# Altium schematic sheet Connectors.SchDoc
size A4
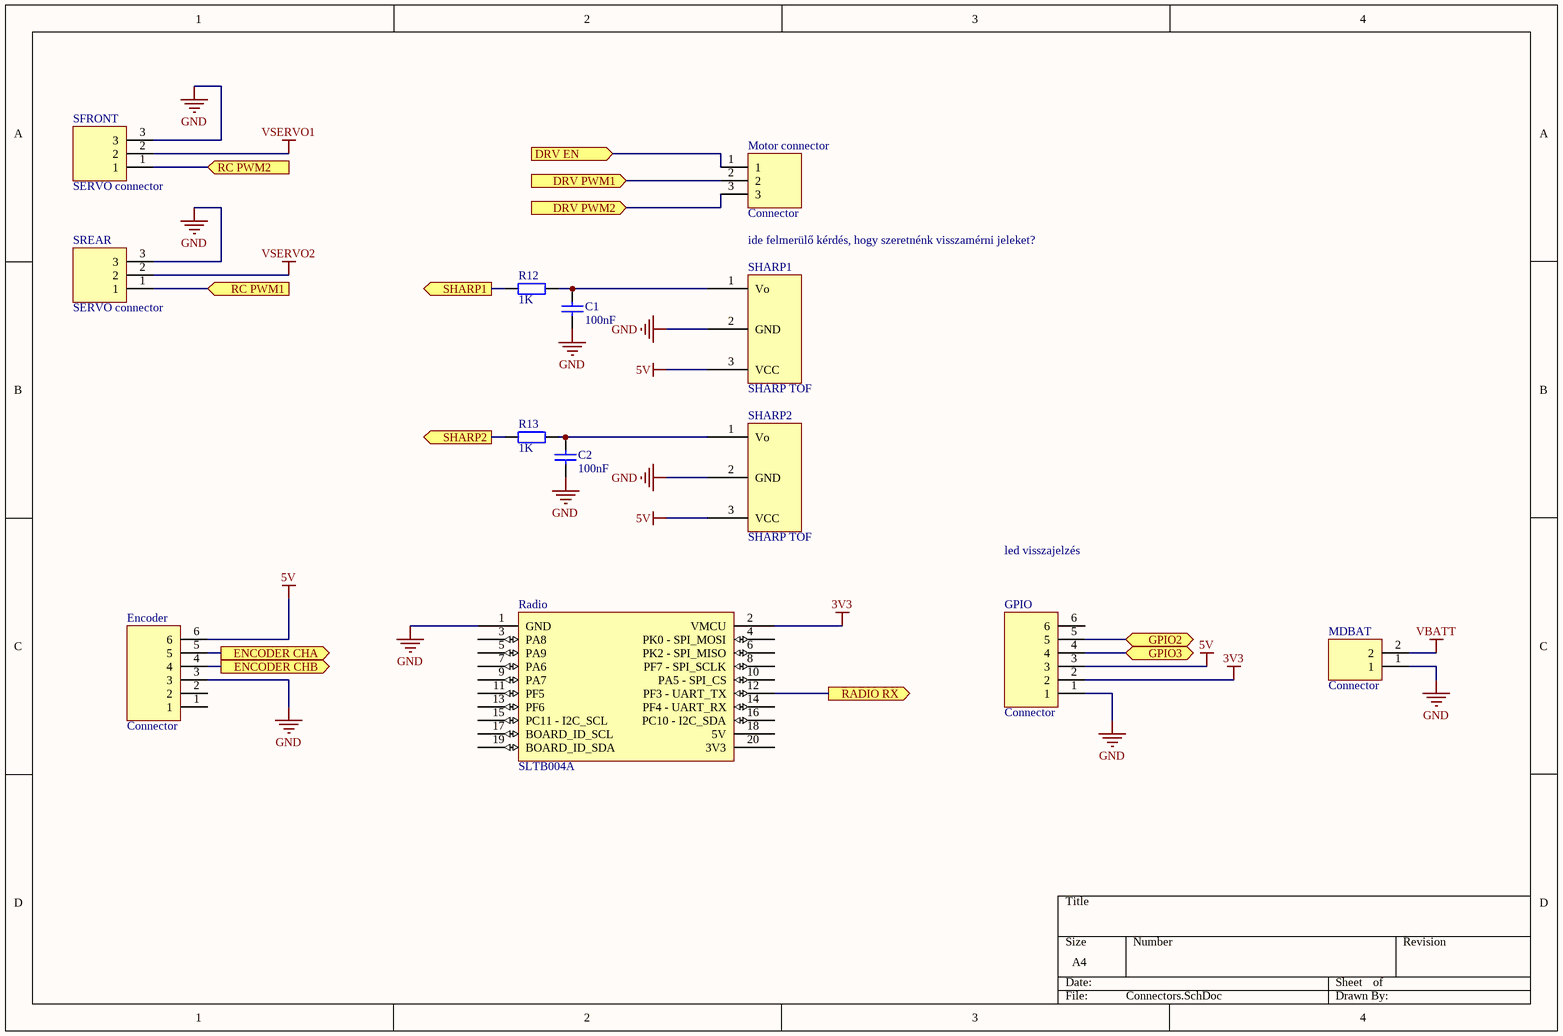
[diagram p0: Connectors.SchDoc]

## Parts
C1  100nF  [FP_0805_CAP_085]
C2  100nF  [FP_0805_CAP_085]
Encoder  Connector  [FP_CONN6PIN_2X3_254]
GPIO  Connector  [FP_CONN6PIN_2X3_254]
MDBAT  Connector  [CONN_2pin]
Motor_connector  Connector  [sorkapocs 3 pin]
R12  1K  [FP_0805_RES]
R13  1K  [FP_0805_RES]
Radio  SLTB004A  [SLTB004A]
SFRONT  SERVO connector  [RC_SERVO_CONN]
SHARP1  SHARP TOF  [SHARP TOF]
SHARP2  SHARP TOF  [SHARP TOF]
SREAR  SERVO connector  [RC_SERVO_CONN]

## Ports
DRV EN (in), DRV PWM1 (in), DRV PWM2 (in), ENCODER CHA (out), ENCODER CHB (out), GPIO2 (bidir), GPIO3 (bidir), RADIO RX (out), RC PWM1 (in), RC PWM2 (in), SHARP1 (out), SHARP2 (out)

## Nets
3V3: GPIO.2 Radio.2(VMCU)
5V: Encoder.6 GPIO.3 SHARP1.3(VCC) SHARP2.3(VCC)
GND: C1.1 C2.1 Encoder.3 GPIO.1 MDBAT.1 Radio.1(GND) SFRONT.3 SHARP1.2(GND) SHARP2.2(GND) SREAR.3
VBATT: MDBAT.2
VSERVO1: SFRONT.2
VSERVO2: SREAR.2
DRV EN: Motor_connector.1 ; port DRV EN
DRV PWM1: Motor_connector.2 ; port DRV PWM1
DRV PWM2: Motor_connector.3 ; port DRV PWM2
ENCODER CHA: Encoder.5 ; port ENCODER CHA
ENCODER CHB: Encoder.4 ; port ENCODER CHB
GPIO2: GPIO.5 ; port GPIO2
GPIO3: GPIO.4 ; port GPIO3
RADIO RX: Radio.12(PF3_-_UART_TX) ; port RADIO RX
RC PWM1: SREAR.1 ; port RC PWM1
RC PWM2: SFRONT.1 ; port RC PWM2
SHARP1: R12.1 ; port SHARP1
SHARP2: R13.1 ; port SHARP2
NetC1_2: C1.2 R12.2 SHARP1.1(Vo)
NetC2_2: C2.2 R13.2 SHARP2.1(Vo)

Not connected (* = marked no-connect by the designer): Encoder 1 2; GPIO 6; Radio 3(PA8) 4(PK0_-_SPI_MOSI) 5(PA9) 6(PK2_-_SPI_MISO) 7(PA6) 8(PF7_-_SPI_SCLK) 9(PA7) 10(PA5_-_SPI_CS) 11(PF5) 13(PF6) 14(PF4_-_UART_RX) 15(PC11_-_I2C_SCL) 16(PC10_-_I2C_SDA) 17(BOARD_ID_SCL) 18(5V) 19(BOARD_ID_SDA) 20(3V3)

## Notes on the sheet
- ide felmerülő kérdés, hogy szeretnénk visszamérni jeleket?
- led visszajelzés

## Library data of the parts
C1 C2 = CAP: Capacitor; Value: 100nF
Encoder GPIO = Connector_6pin: 6pin connector
MDBAT = Connector_2pin: 2pin connector
Motor_connector SFRONT SREAR = Connector_3pin: 3pin connector
R12 R13 = RES: Resistor; Value: 1K
Radio = SLTB004A: SiLabs Thunderboard Sense 2 module